# Altium schematic sheet Sheet_1_2022-02-26.schdoc
size 405 x 265 mm
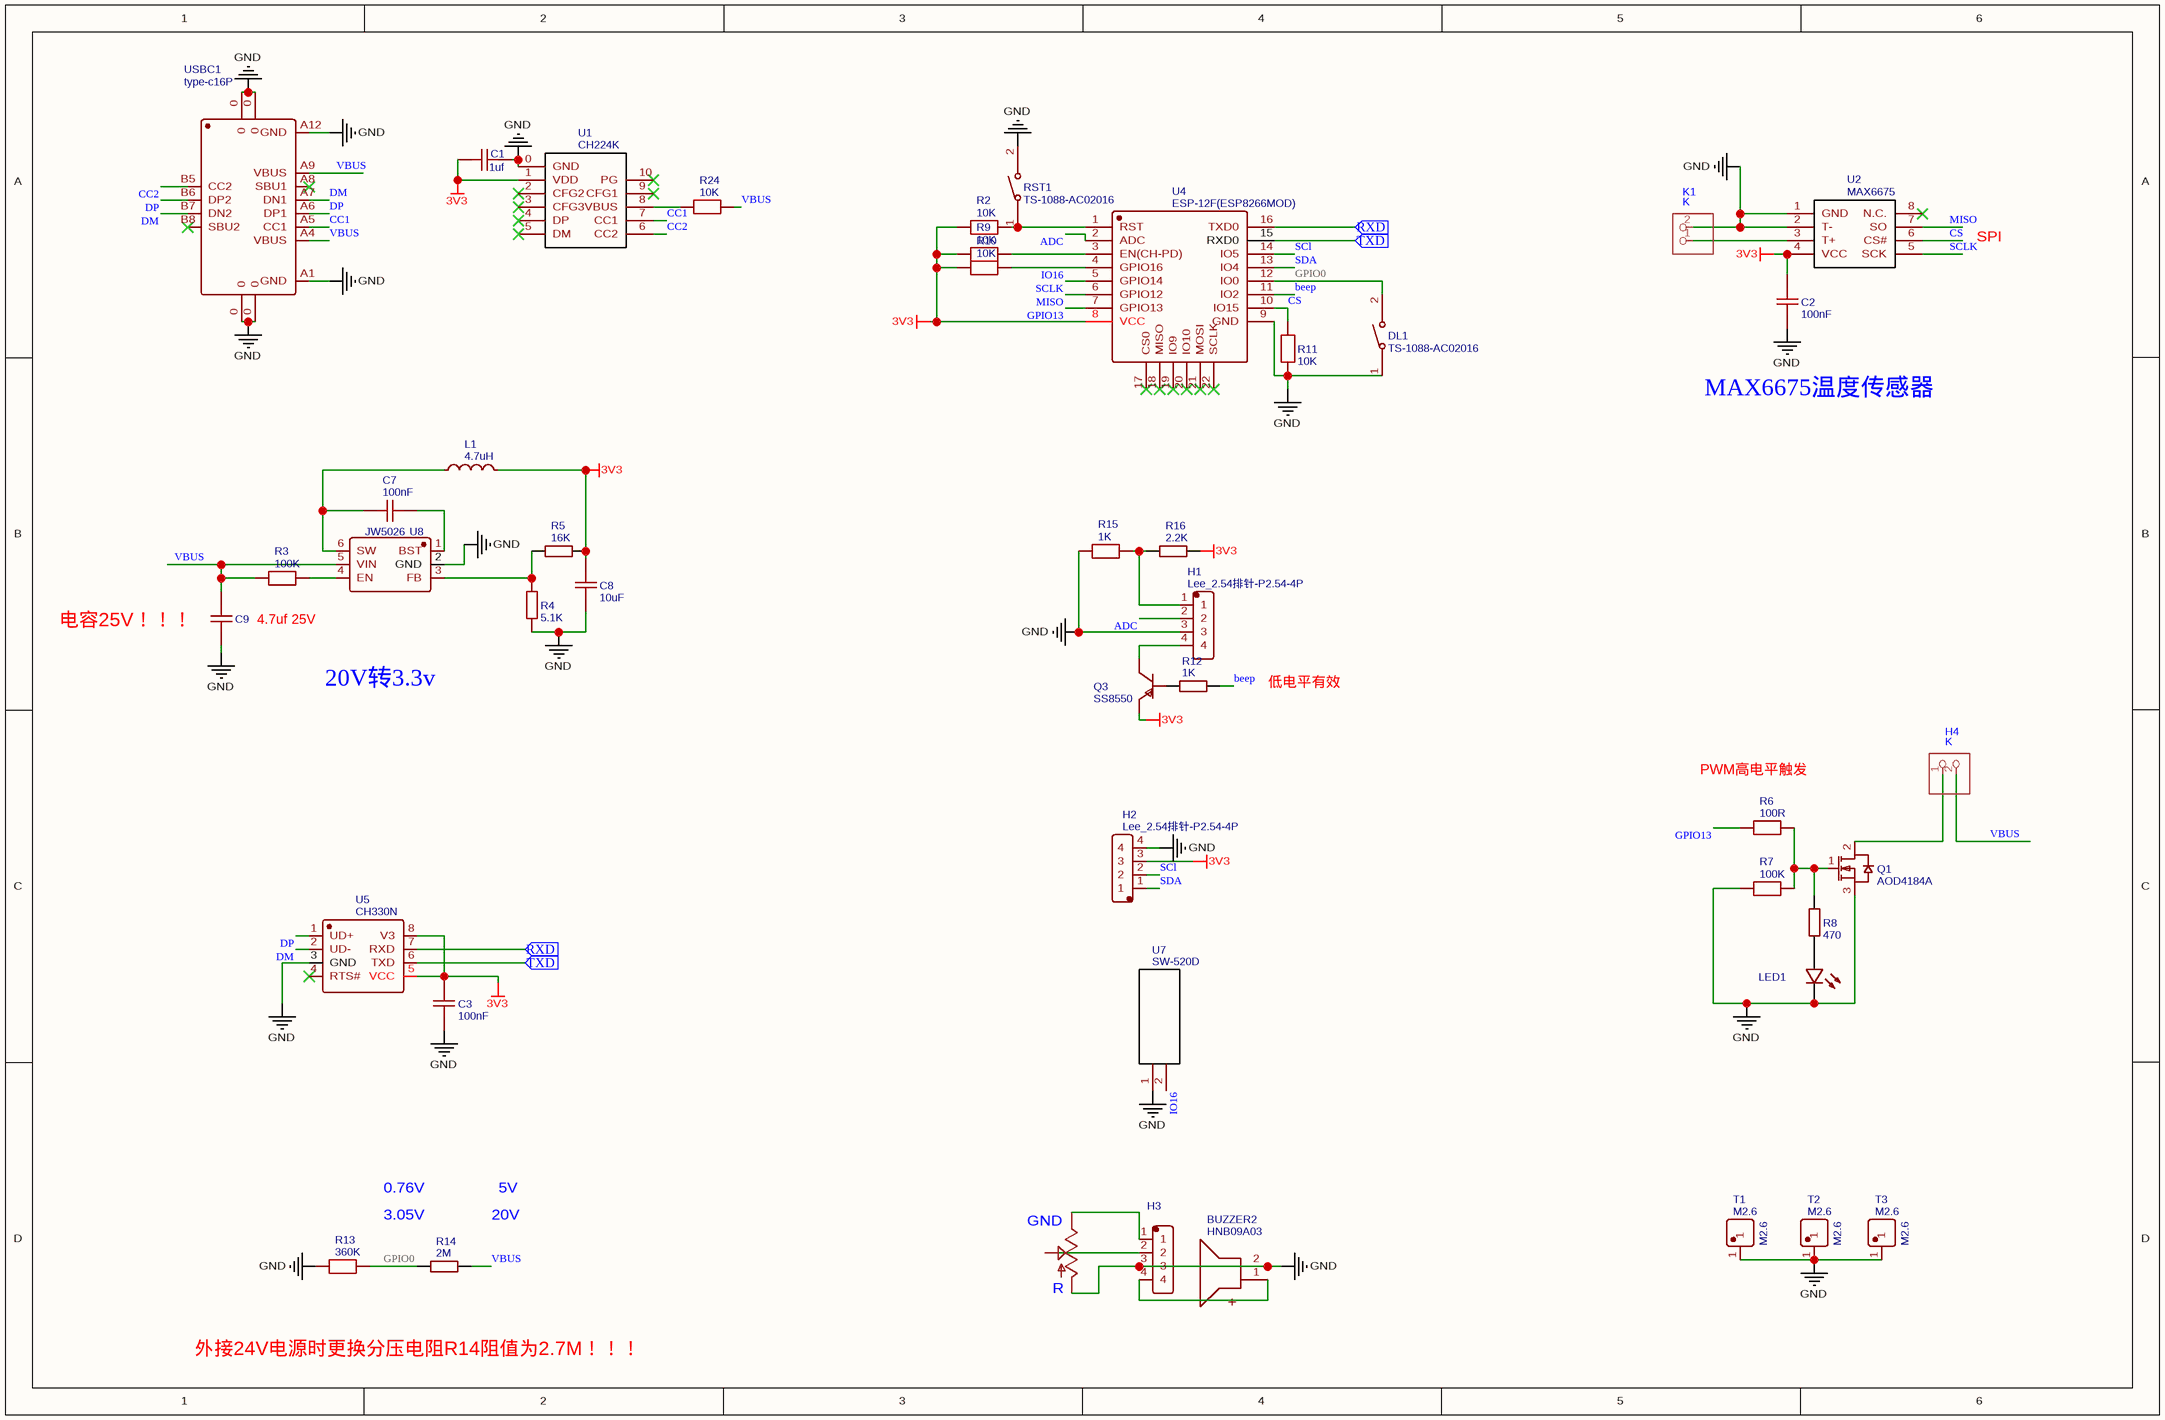
[diagram p0: Sheet_1_2022-02-26.schdoc]

## Parts
BUZZER2  HNB09A03  [BUZ-TH_BD9.0-P5.00-D0.6-FD]
C1  1uf  [C0402]
C2  100nF  [C0402]
C3  100nF  [C0402]
C7  100nF  [C0402]
C8  10uF  [C0402]
C9  4.7uf 25V  [C0402]
DL1  TS-1088-AC02016  [SW-SMD_L4.0-W2.9-LS5.0-A]
H1  Lee_2.54排针-P2.54-4P  [LEE_2.54排针-P2.54-4P]
H2  Lee_2.54排针-P2.54-4P  [LEE_2.54排针-P2.54-4P]
H3  Lee_2.54排针-P2.54-4P  [LEE_2.54排针-P2.54-4P]  (value not drawn)
H4  K  [XH2.54-2]
K1  K  [XH2.54-2]
L1  4.7uH  [IND-SMD_L2.5-W2.0]
LED1  19-217/GHC-YR1S2/3T  [LED0805_RED]  (value not drawn)
Q1  AOD4184A  [TO-252-2_L6.6-W6.1-P4.57-LS9.9-TL-CW]
Q3  SS8550  [SOT-23-3_L2.9-W1.3-P1.90-LS2.4-BR]
R2  10K  [R0402]
R3  100K  [R0402]
R4  5.1K  [R0402]
R5  16K  [R0402]
R6  100R  [R0402]
R7  100K  [R0402]
R8  470  [R0402]
R9  10K  [R0402]
R10  10K  [R0402]
R11  10K  [R0402]
R12  1K  [R0402]
R13  360K  [R0402]
R14  2M  [R0402]
R15  1K  [R0402]
R16  2.2K  [R0402]
R24  10K  [R0402]
RST1  TS-1088-AC02016  [SW-SMD_L4.0-W2.9-LS5.0-A]
T1  M2.6  [螺钉孔M2.6]
T2  M2.6  [螺钉孔M2.6]
T3  M2.6  [螺钉孔M2.6]
U1  CH224K  [ESSOP10-EP]
U2  MAX6675  [SOIC-8_L5.0-W4.0-P1.27-LS6.0-BL]
U4  ESP-12F(ESP8266MOD)  [WIFIM-SMD_ESP-12F-ESP8266MOD]
U5  CH330N  [SOP-8_L4.9-W3.9-P1.27-LS6.0-BL]
U7  SW-520D  [SW-520D]
U8  JW5026  [SOT-23-6_L2.9-W1.6-P0.95-LS2.8-BL]
U10  B103单联  [B103单联拨盘电位器]  (value not drawn)
USBC1  type-c16P  [USB-C-SMD_TYPE-C-USB-17]

## Ports
RXD (in), TXD (in)

## Nets
3V3: C1.2 C2.1 C3.1 C8.2 H2.3 L1.2 Q3.3(C) R2.1 R5.2 R9.1 R10.1 R16.2 U1.1(VDD) U2.4(VCC) U4.8(VCC) U5.5(VCC) U5.8(V3)
GND: BUZZER2.2(-) C1.1 C2.2 C3.2 C8.1 C9.1 DL1.1 H1.3 H2.4 H3.3 K1.2 LED1.2(C) Q1.3(S) R4.1 R7.1 R11.1 R13.1 R15.1 RST1.2 T1.1 T2.1 T3.1 U1.0(GND) U2.1(GND) U2.2(T-) U4.9(GND) U5.3(GND) U7.1 U8.2(GND) U10.3(A) USBC1.0 USBC1.A1(GND) USBC1.A12(GND)
ADC: H1.2 U4.2(ADC)
beep: R12.1 U4.11(IO2)
CC1: U1.7(CC1) USBC1.A5(CC1)
CC2: U1.6(CC2) USBC1.B5(CC2)
CS: R11.2 U2.6(CS#) U4.10(IO15)
DM: U5.2(UD-) USBC1.A7(DN1) USBC1.B7(DN2)
DP: U5.1(UD+) USBC1.A6(DP1) USBC1.B6(DP2)
GPIO0: DL1.2 R13.2 R14.1 U4.12(IO0)
GPIO13: R6.1 U4.7(GPIO13)
IO16: R10.2 U4.4(GPIO16) U7.2
MISO: U2.7(SO) U4.6(GPIO12)
RXD: U4.16(TXD0) U5.7(RXD) ; port RXD
SCl: H2.2 U4.14(IO5)
SCLK: U2.5(SCK) U4.5(GPIO14)
SDA: H2.1 U4.13(IO4)
TXD: U4.15(RXD0) U5.6(TXD) ; port TXD
VBUS: C9.2 H4.2 R3.1 R14.2 R24.2 U8.5(VIN) USBC1.A4(VBUS) USBC1.A9(VBUS)
NetBUZZER2_1: BUZZER2.1(+) H3.4
NetC7_1: C7.1 U8.1(BST)
NetC7_2: C7.2 L1.1 U8.6(SW)
NetH1_1: H1.1 R15.2 R16.1
NetH1_4: H1.4 Q3.2(E)
NetH3_1: H3.1 U10.1(E)
NetH3_2: H3.2 U10.2(S)
NetH4_1: H4.1 Q1.2(D)
NetK1_1: K1.1 U2.3(T+)
NetLED1_1: LED1.1(A) R8.2
NetQ1_1: Q1.1(G) R6.2 R7.2 R8.1
NetQ3_1: Q3.1(B) R12.2
NetR2_2: R2.2 RST1.1 U4.1(RST)
NetR3_2: R3.2 U8.4(EN)
NetR4_2: R4.2 R5.1 U8.3(FB)
NetR9_2: R9.2 U4.3(EN(CH-PD))
NetR24_1: R24.1 U1.8(VBUS)

Not connected (* = marked no-connect by the designer): U1 2(CFG2)* 3(CFG3)* 4(DP)* 5(DM)* 9(CFG1)* 10(PG)*; U2 8(N.C.)*; U4 17(CS0)* 18(MISO)* 19(IO9)* 20(IO10)* 21(MOSI)* 22(SCLK)*; U5 4(RTS#)*; USBC1 A8(SBU1)* B8(SBU2)*

## Notes on the sheet
- SPI
- MAX6675温度传感器
- 电容25V！！！
- 20V转3.3v
- 低电平有效
- (near R6) PWM高电平触发
- 0.76V
- 3.05V
- 20V
- 5V
- 外接24V电源时更换分压电阻R14阻值为2.7M！！！
- (in symbol B103单联) GND; R

## Library data of the parts
BUZZER2 = HNB09A03: BOM_Manufacturer: Jiangsu Huaneng Elec; Contributor: LCSC; BOM_Supplier: LCSC; BOM_Supplier Part: C96102; BOM_Manufacturer Part: HNB09A03; BOM_JLCPCB Part Class: Extended Part; spicePre: B; spiceSymbolName: HNB09A03
C1 = 1uf: nameAlias: Value(F); Contributor: LCEDA_Lib; BOM_Supplier Part: C2887020; BOM_Supplier: LCSC; spicePre: C; spiceSymbolName: C_0603_US
C2 C3 C7 = 100nF: BOM_Manufacturer: Walsin Tech Corp; BOM_Manufacturer Part: 0402X104K500CT; nameAlias: Capacitance; Contributor: LCSC; BOM_Supplier: LCSC; BOM_Supplier Part: C387959; spicePre: C; spiceSymbolName: 0402X104K500CT
C8 = 10uF: BOM_Manufacturer: Samsung Electro-Mechanics; BOM_Manufacturer Part: CL05A106MP5NUNC; nameAlias: Capacitance; Contributor: LCSC; BOM_Supplier: LCSC; BOM_Supplier Part: C315248; spicePre: C; spiceSymbolName: CL05A106MP5NUNC_C315248
C9 = 4.7uf 25V: nameAlias: Value(F); Contributor: LCEDA_Lib; BOM_Supplier Part: C2858031; BOM_Supplier: LCSC; spicePre: C; spiceSymbolName: C_0402_US
DL1 RST1 = TS-1088-AC02016: BOM_Manufacturer: XUNPU; Contributor: LCSC; BOM_Supplier: LCSC; BOM_Supplier Part: C720475; BOM_Manufacturer Part: TS-1088-AC02016; BOM_JLCPCB Part Class: Extended Part; spicePre: S; spiceSymbolName: TS-1088-AC02016
H1-H3 = Lee_2.54排针-P2.54-4P: BOM_Manufacturer: Ckmtw; BOM_Manufacturer Part: 210S-1*4P L=11.6MMGold-plated black; Contributor: EdwardLee2020; BOM_Supplier: LCSC; BOM_Supplier Part: C124378; spicePre: H; spiceSymbolName: Lee_2.54排针-P2.54-4P
H4 K1 = K: BOM_Manufacturer: TE Connectivity; BOM_Manufacturer Part: 826629-2; BOM_Supplier: LCSC; BOM_Supplier Part: C86471
L1 = 4.7uH: BOM_Manufacturer: Sunlord; BOM_Manufacturer Part: SWPA252012S4R7MT; nameAlias: Inductance; BOM_Supplier: LCSC; BOM_Supplier Part: C87640; BOM_JLCPCB Part Class: Extended Part; spicePre: L; spiceSymbolName: SWPA252012S4R7MT
LED1 = 19-217/GHC-YR1S2/3T: BOM_Manufacturer: EVERLIGHT; BOM_Supplier: LCSC; BOM_Manufacturer Part: 19-217/GHC-YR1S2/3T; BOM_LCSC Assembly: Yes; image: //image.lceda.cn/szlcsc/C72043.jpg; spicePre: L; BOM_Supplier Part: C181863
Q1 = AOD4184A: BOM_Manufacturer: AOS; Contributor: LCSC; SMT Type: Extend; Package Display: No; BOM_Supplier: LCSC; BOM_Manufacturer Part: AOD4184A; BOM_Supplier Part: C99124; link: http://www.aosmd.com/res/data_sheets/AOD4184A.pdf; BOM_LCSC Assembly: Yes; spicePre: Q; spiceSymbolName: AOD4184A
Q3 = SS8550: BOM_Manufacturer: Bourne Semicon (Shenzhen); Contributor: SmileWJ; BOM_Supplier: LCSC; BOM_Supplier Part: C266595; BOM_Manufacturer Part: SS8550; spicePre: Q; spiceSymbolName: SS8550
R2 R9-R11 R24 = 10K: BOM_Manufacturer: KOA Speer Elec; BOM_Manufacturer Part: RK73G1ETTP1002F; Contributor: LCSC; BOM_Supplier: LCSC; BOM_Supplier Part: C830216; spicePre: R; spiceSymbolName: RK73G1ETTP1002F
R3 R7 = 100K: BOM_Manufacturer: YAGEO; BOM_Manufacturer Part: RC0402FR-7W100KL; nameAlias: Resistance (Ohms); Contributor: LCSC; BOM_Supplier: LCSC; BOM_Supplier Part: C606167; spicePre: R; spiceSymbolName: RC0402FR-7W100KL
R4 = 5.1K: nameAlias: Resistance (Ohms); Contributor: LCSC; BOM_Paste Type: Extended Part; BOM_Supplier: LCSC; BOM_Supplier Part: C25905; BOM_JLCPCB Part Class: Extended Part; spicePre: R; spiceSymbolName: RMC04022.4K1%N
R5 = 16K: BOM_Manufacturer Part: 0402WGF7501TCE; nameAlias: Resistance (Ohms); BOM_Supplier: LCSC; BOM_Supplier Part: C226690; BOM_JLCPCB Part Class: Basic Part; spicePre: R; spiceSymbolName: 0402WGF7501TCE
R6 = 100R: BOM_Manufacturer: YAGEO; BOM_Manufacturer Part: RT0402BRE07100RL; Contributor: LCSC; BOM_Supplier: LCSC; BOM_Supplier Part: C705641; BOM_JLCPCB Part Class: Extended Part; spicePre: R; spiceSymbolName: RT0402BRE07100RL
R8 = 470: BOM_Manufacturer: UniOhm; BOM_Manufacturer Part: 0805W8F1002T5E; nameAlias: Resistance (Ohms); SMT Type: Basic; BOM_Supplier: LCSC; BOM_LCSC Assembly: Yes; BOM_Supplier Part: C17414; spicePre: R; spiceSymbolName: 0805W8F1002T5E
R12 = 1K: BOM_Manufacturer: UniOhm; BOM_Manufacturer Part: 0805W8F1002T5E; nameAlias: Resistance (Ohms); SMT Type: Basic; BOM_Supplier: LCSC; BOM_LCSC Assembly: Yes; BOM_Supplier Part: C17414; spicePre: R; spiceSymbolName: 0805W8F1002T5E
R13 = 360K: BOM_Manufacturer: Vishay Intertech; BOM_Manufacturer Part: CRCW0402360KFKED; Contributor: LCSC; BOM_Supplier: LCSC; BOM_Supplier Part: C482154; spicePre: R; spiceSymbolName: CRCW0402360KFKED
R14 = 2M: BOM_Manufacturer: UniOhm; BOM_Manufacturer Part: 0402WGF2004TCE; nameAlias: Resistance (Ohms); BOM_Supplier: LCSC; BOM_Supplier Part: C11512; BOM_JLCPCB Part Class: Extended Part; spicePre: R; spiceSymbolName: 0402WGF2004TCE
R15 = 1K: BOM_Manufacturer: YAGEO; BOM_Manufacturer Part: AC0402DR-071KL; nameAlias: Resistance (Ohms); Contributor: LCSC; BOM_Paste Type: Extended Part; BOM_Supplier: LCSC; BOM_Supplier Part: C226698; BOM_JLCPCB Part Class: Extended Part; JLCPCB Part Class: Extended Part; spicePre: R; spiceSymbolName: AC0402DR-071KL
R16 = 2.2K: BOM_Manufacturer: UniOhm; BOM_Manufacturer Part: 0402WGF2201TCE; nameAlias: Resistance (Ohms); BOM_Supplier: LCSC; BOM_Supplier Part: C25879; BOM_JLCPCB Part Class: Basic Part; spicePre: R; spiceSymbolName: 0402WGF2201TCE
T1-T3 = M2.6: Contributor: wowlkh; spicePre: T; spiceSymbolName: M2.6
U1 = CH224K: BOM_Manufacturer: 南京沁恒微电子; Contributor: hans_1024; spicePre: U; spiceSymbolName: CH224K
U2 = MAX6675: BOM_Manufacturer: MAXIM; BOM_Manufacturer Part: MAX6675ISA+T; SMT Type: Extend; Package Display: No; BOM_Supplier: LCSC; image: //image.lceda.cn/szlcsc/C16030.jpg; BOM_Supplier Part: C16030; BOM_LCSC Assembly: Yes; spicePre: U; spiceSymbolName: MAX6675ISA+T
U4 = ESP-12F(ESP8266MOD): BOM_Manufacturer: Ai-Thinker; BOM_Supplier: LCSC; BOM_Manufacturer Part: ESP-12F(ESP8266MOD); BOM_Supplier Part: C82891; spicePre: U; spiceSymbolName: ESP-12F(ESP8266MOD)
U5 = CH330N: BOM_Manufacturer: WCH; BOM_Supplier: LCSC; BOM_Manufacturer Part: CH330N; BOM_Supplier Part: C108996; spicePre: U; spiceSymbolName: CH330N
U7 = SW-520D: Contributor: jimson.hu; BOM_Manufacturer Part: SW-520D; spicePre: U; spiceSymbolName: SW-520D
U8 = JW5026: BOM_Manufacturer: JoulWatt Tech; Contributor: LCSC; SMT Type: Extend; BOM_Supplier: LCSC; BOM_Supplier Part: C185109; BOM_Manufacturer Part: JW5026; BOM_LCSC Assembly: Yes; spicePre: U; spiceSymbolName: JW5026
U10 = B103单联: Contributor: lualiliu; BOM_Manufacturer Part: B103单联; spicePre: U; spiceSymbolName: B103单联
USBC1 = type-c16P: BOM_Manufacturer: LCSC; BOM_Paste Type: Extended Part; BOM_Supplier: LCSC; BOM_Supplier Part: C167321; BOM_Manufacturer Part: -; Contributor: LCSC; BOM_JLCPCB Part Class: Extended Part; spicePre: U; spiceSymbolName: USB3.1C16PFSMT COPY